# EasyEDA Pro project ProProject_【2023电赛】2023年电赛控制术_2023-08-01.epro, schematic v1
Create Date: 2023-07-21; Page Name: P1; Project Name: 【2023电赛】2023年电赛控制术; Schematic Name: v1; Update Date: 2023-07-31; Company: 桂林信息科技学院; Drawed: Jsir2022; Page Size: A4; Reviewed: QQ1171690935; Version: V1
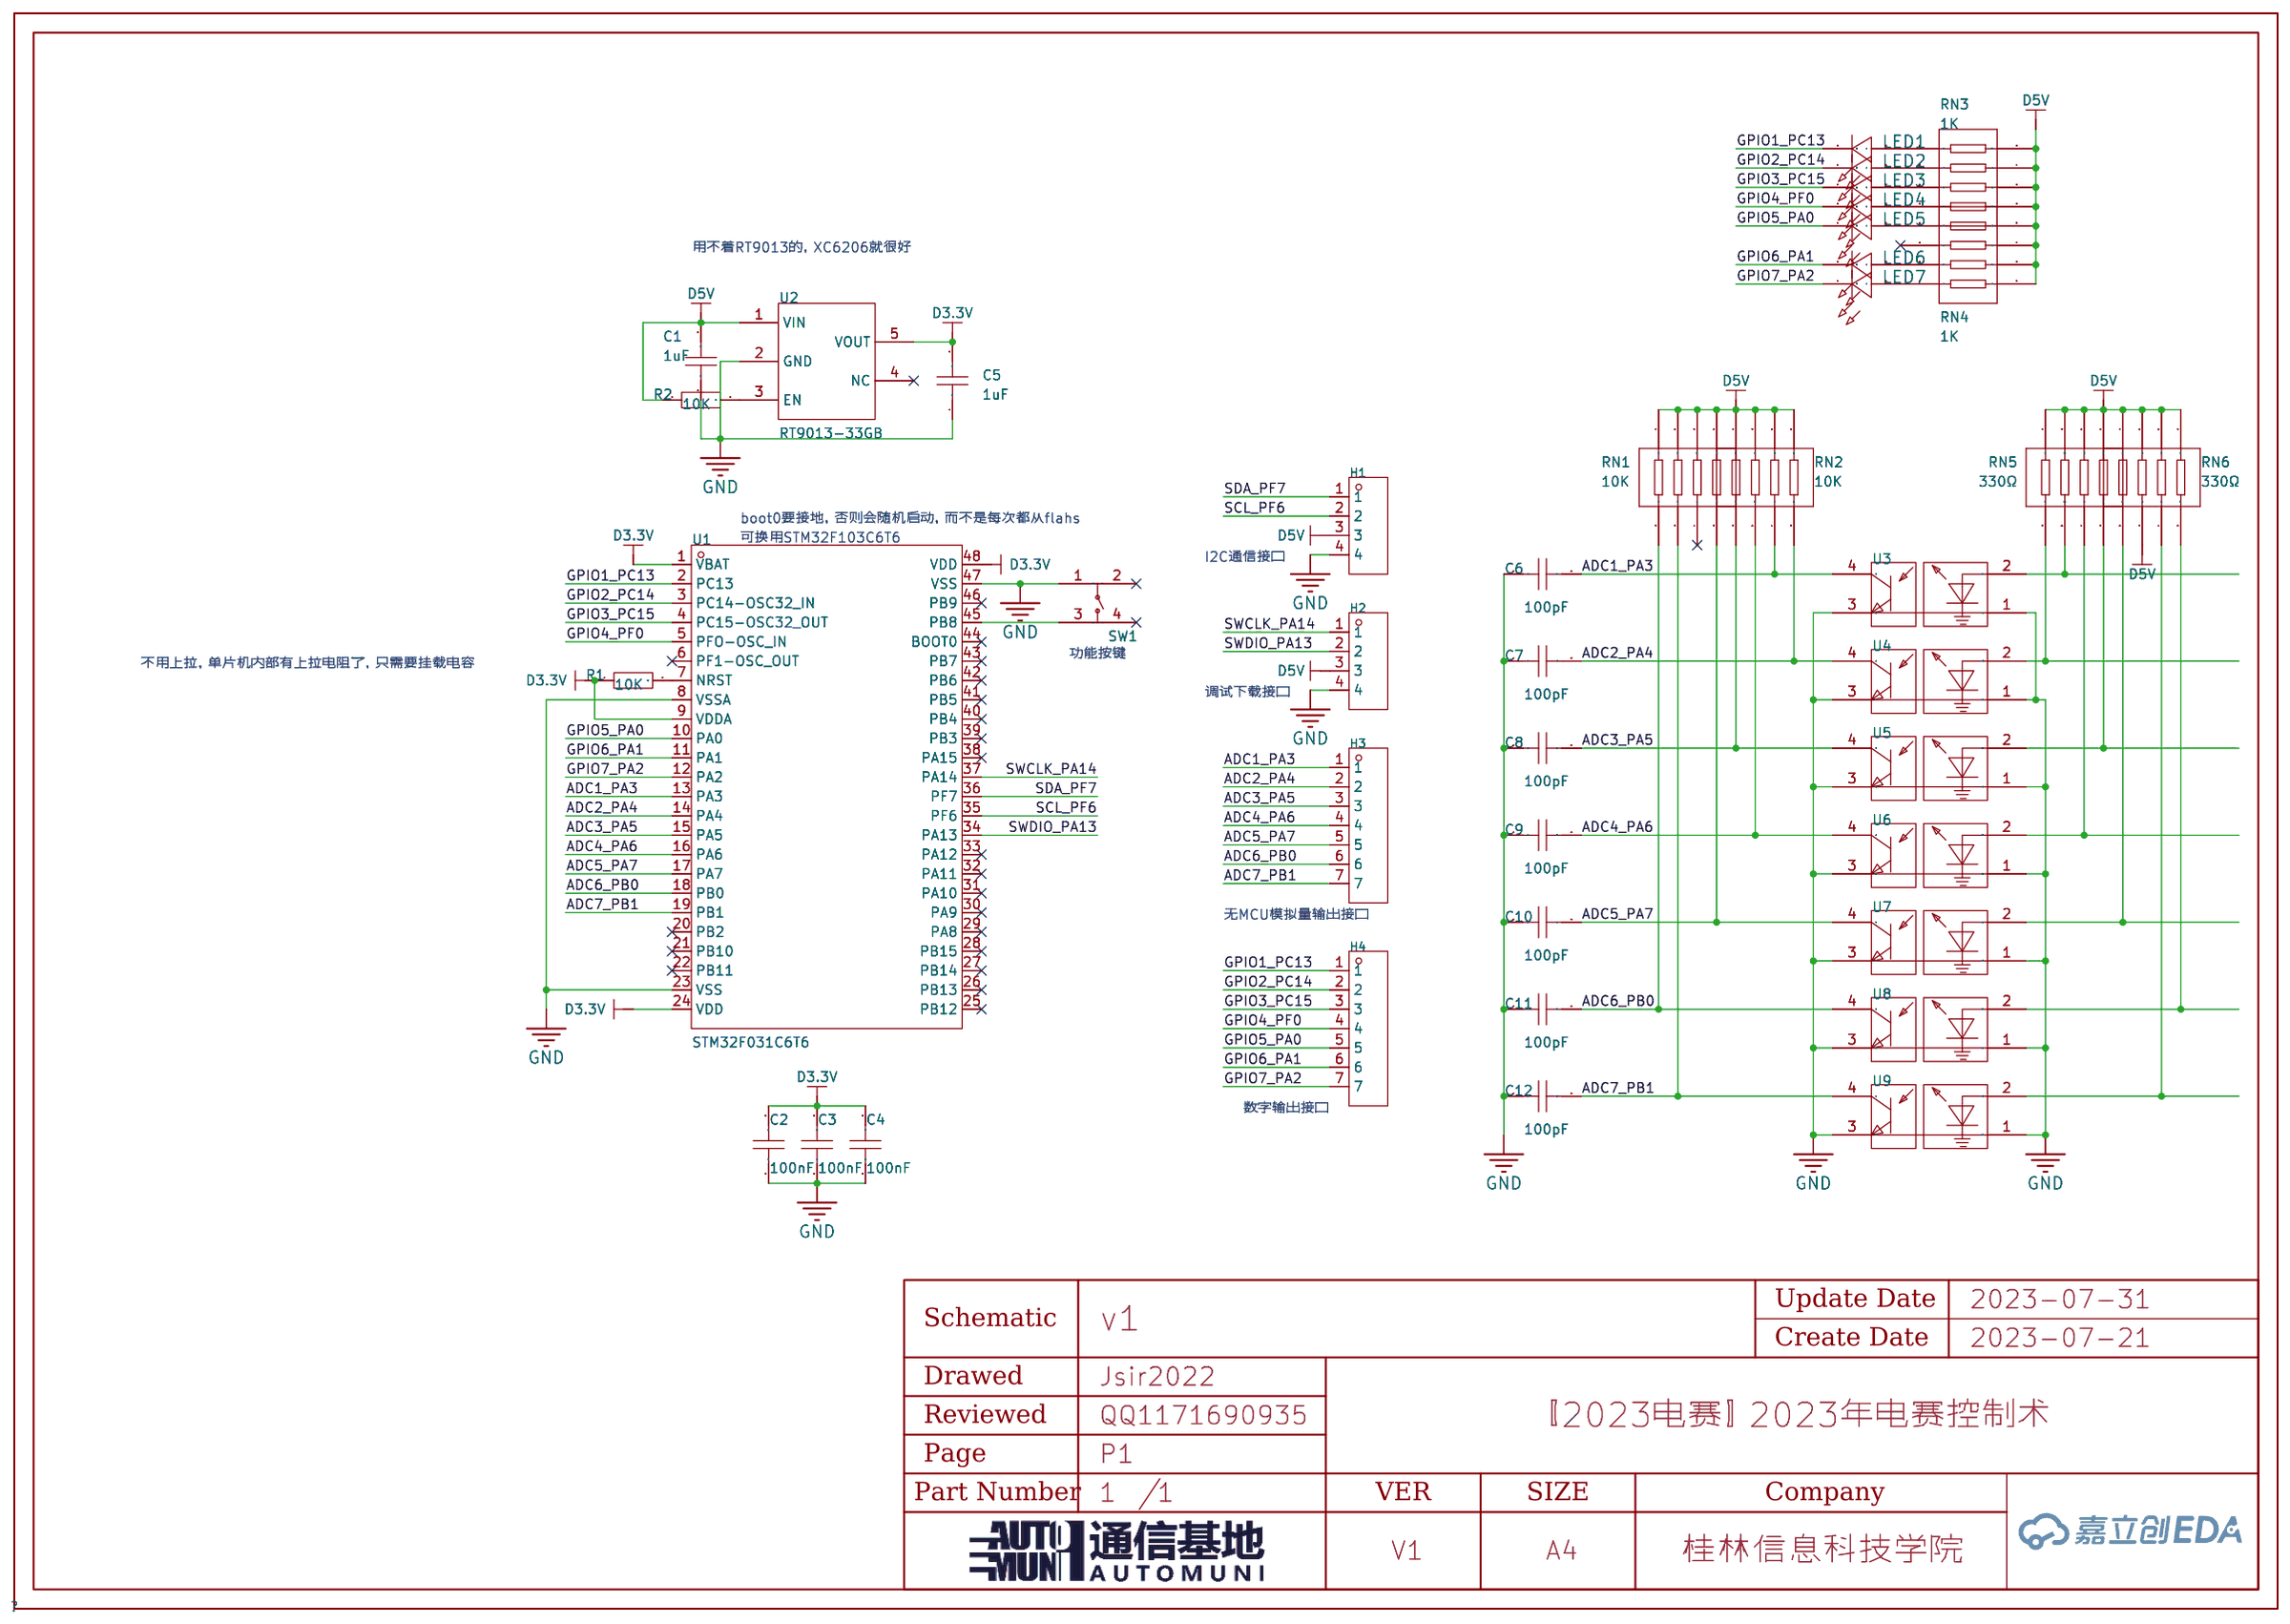
[diagram p0: schematic sheet]

## Parts
C1  1uF  [C0603]
C2  100nF  [C0603]
C3  100nF  [C0603]
C4  100nF  [C0603]
C5  1uF  [C0603]
C6  100pF  [C0603]
C7  100pF  [C0603]
C8  100pF  [C0603]
C9  100pF  [C0603]
C10  100pF  [C0603]
C11  100pF  [C0603]
C12  100pF  [C0603]
H1  -  [HDR-TH_4P-P2.54-V-M]
H2  -  [HDR-TH_4P-P2.54-V-M]
H3  -  [HDR-TH_7P-P2.54-V-M]
H4  -  [HDR-TH_7P-P2.54-V-M]
LED1  -  [LED_0603]
LED2  -  [LED_0603]
LED3  -  [LED_0603]
LED4  -  [LED_0603]
LED5  -  [LED_0603]
LED6  -  [LED_0603]
LED7  -  [LED_0603]
R1  10K  [R0603]
R2  10K  [R0603]
RN1  10K  [RES-ARRAY-SMD_0402-8P-L2.0-W1.0-BL]
RN2  10K  [RES-ARRAY-SMD_0402-8P-L2.0-W1.0-BL]
RN3  1K  [RES-ARRAY-SMD_0402-8P-L2.0-W1.0-BL]
RN4  1K  [RES-ARRAY-SMD_0402-8P-L2.0-W1.0-BL]
RN5  330Ω  [RES-ARRAY-SMD_0402-8P-L2.0-W1.0-BL]
RN6  330Ω  [RES-ARRAY-SMD_0402-8P-L2.0-W1.0-BL]
SW1  TS-1089S-AR02516  [SW-SMD_4P-L4.2-W3.3-P2.15-LS5.1]
U1  STM32F031C6T6  [LQFP-48_L7.0-W7.0-P0.50-LS9.0-BL]
U2  RT9013-33GB  [SOT-23-5_L3.0-W1.7-P0.95-LS2.8-BL]
U3  ITR9909  [OPTO-TH_ITR9909]
U4  ITR9909  [OPTO-TH_ITR9909]
U5  ITR9909  [OPTO-TH_ITR9909]
U6  ITR9909  [OPTO-TH_ITR9909]
U7  ITR9909  [OPTO-TH_ITR9909]
U8  ITR9909  [OPTO-TH_ITR9909]
U9  ITR9909  [OPTO-TH_ITR9909]

## Library data of the parts
C1-C12 = CAP_0603: Supplier Footprint: 0603
H1 H2 = HDR-M_2.54_1x4P: Supplier Part: C492403; Supplier Footprint: 插件
H3 H4 = HDR-M_2.54_1x7P: Supplier Part: C492406; Supplier Footprint: 插件
LED1-LED7 = LED_0603-R: Supplier Footprint: 0603
R1 R2 = Res_0603: Supplier Footprint: 0603
RN1-RN6 = YC124-JR-07330RL: 阻值:330Ω;精度:±5%;单个元件功率:62.5mW;电阻器数:4;; LCSC Part Name: 330Ω ±5% 0402x4; Supplier Part: C136846; Manufacturer: YAGEO(国巨); Supplier Footprint: 0402x4; JLCPCB Part Class: Extended Part; Datasheet: https://atta.szlcsc.com/upload/public/pdf/source/20171106/C136846_15099533593141092631.pdf; Supplier: LCSC; Tolerance: ±5%; Power(Watts): 62.5mW; Number of Resistors: 4; Number of Pins: 8; Temperature Coefficient: ±200ppm/℃
SW1 = TS-1089S-AR02516: 触点电流:50mA;额定电压(DC):12V;绝缘电阻:100MΩ;电路结构:单刀单掷;安装方式:立贴;按钮形状:椭圆形按钮;按钮/盖帽颜色:白色;作用力:160gf@±50gf;机械寿命:100000;工作温度:-30~+80;引脚样式:SMD接片;开关长度:4.2mm;开关宽度:3.25mm;开关高度:2.5mm;带支架:否;; LCSC Part Name: 342.5 160gf 轻触开关; Supplier Part: C720479; Manufacturer: XUNPU(讯普); Supplier Footprint: SMD; JLCPCB Part Class: Extended Part; Datasheet: https://atta.szlcsc.com/upload/public/pdf/source/20200810/C720479_389650BB8B865DD3822BD59B78D6CF64.pdf; Supplier: LCSC; Contact Current: 50mA; Voltage Rating (DC): 12V; Insulation Resistance: 100MΩ; Circuit: 单刀单掷; Mounting Style: 立贴; Actuator Style: 椭圆形按钮; Actuator/Cap Color: 白色; Operating Force: 160gf@±50gf; Mechanical Life: 100000; Operating Temperature: -30~+80; Pin Style: SMD接片; Switch Length: 4.2mm; Switch Width: 3.25mm; Switch Height: 2.5mm; Strike Gundam: 否
U1 = STM32F031C6T6: CPU内核:ARM Cortex-M0;CPU最大主频:48MHz;工作电压范围:2V~3.6V;内部振荡器:有;程序 FLASH容量:32K@x8bit;RAM总容量:4KB;EEPROM/数据 FLASH容量:-;GPIO端口数量:39;ADC(单元数/通道数/位数):1@x13ch/12bit;外设/功能/协议栈:DMA；看门狗；POR；PWM;工作温度范围:-40℃~+85℃;; LCSC Part Name: ARM Cortex-M0 48MHz 闪存：32K@x8bit RAM：4KB; Supplier Part: C97413; Manufacturer: ST(意法半导体); Supplier Footprint: LQFP-48(7x7); JLCPCB Part Class: Extended Part; Datasheet: https://atta.szlcsc.com/upload/public/pdf/source/20170925/C97413_1506321779757990583.pdf; Supplier: LCSC; CPU Core: ARM Cortex-M0; Maximum Frequency: 48MHz; Supply Voltage Range: 2V~3.6V; Internal Oscillator: 有; Program FLASH Size: 32K@x8bit; RAM Size: 4KB; GPIO Ports Number: 39; ADC (Units/Channels/bits): 1@x13ch/12bit; Peripherals / Functions / Protocol Stacks: DMA；看门狗；POR；PWM; Operating Temperature Range: -40℃~+85℃
U2 = RT9013-33GB: 输出类型:固定;输出极性:正;最大输入电压:5.5V;输出电压:3.3V;输出电流:500mA;电源纹波抑制比(PSRR):50dB@(10kHz);; Supplier Part: C47773; Manufacturer: RICHTEK(立锜); Supplier Footprint: SOT-23-5; JLCPCB Part Class: 扩展库; Datasheet: https://atta.szlcsc.com/upload/public/pdf/source/20150504/1457707282459.pdf; Supplier: LCSC; Output Type: 固定; Output Polarity: 正; Number of Outputs: 1; Maximum Input Voltage: 5.5V; Output Voltage: 3.3V; Dropout Voltage: 400mV@(500mA); Output Current: 500mA; Power Supply Rejection Ratio (PSRR): 50dB@(10kHz)
U3-U9 = ITR9909: Supplier Part: C53399; Manufacturer: EVERLIGHT(台湾亿光); Supplier Footprint: DIP-4; JLCPCB Part Class: Extended Part; Datasheet: https://atta.szlcsc.com/upload/public/pdf/source/20201022/C53399_E5C79523D84B21DC4419F8E709CCCF2E.pdf; Supplier: LCSC

## Nets
D3.3V: C2.2 C3.2 C4.2 C5.2 R1.1 U1.1(VBAT) U1.9(VDDA) U1.24(VDD) U1.48(VDD) U2.5(VOUT)
D5V: C1.2 H1.3 H2.3 R2.1 RN1.1 RN1.2 RN1.3 RN1.4 RN2.1 RN2.2 RN2.3 RN2.4 RN3.5 RN3.6 RN3.7 RN3.8 RN4.5 RN4.6 RN4.7 RN4.8 RN5.1 RN5.2 RN5.3 RN5.4 RN6.1 RN6.2 RN6.3 RN6.4 RN6.6 U2.1(VIN)
GND: C1.1 C2.1 C3.1 C4.1 C5.1 C6.1 C7.1 C8.1 C9.1 C10.1 C11.1 C12.1 H1.4 H2.4 SW1.1 U1.8(VSSA) U1.23(VSS) U1.47(VSS) U2.2(GND) U3.1 U3.3 U4.1 U4.3 U5.1 U5.3 U6.1 U6.3 U7.1 U7.3 U8.1 U8.3 U9.1 U9.3
ADC1_PA3: C6.2 H3.1 RN2.7 U1.13(PA3) U3.4
ADC2_PA4: C7.2 H3.2 RN2.8 U1.14(PA4) U4.4
ADC3_PA5: C8.2 H3.3 RN2.5 U1.15(PA5) U5.4
ADC4_PA6: C9.2 H3.4 RN2.6 U1.16(PA6) U6.4
ADC5_PA7: C10.2 H3.5 RN1.8 U1.17(PA7) U7.4
ADC6_PB0: C11.2 H3.6 RN1.5 U1.18(PB0) U8.4
ADC7_PB1: C12.2 H3.7 RN1.6 U1.19(PB1) U9.4
GPIO1_PC13: H4.1 LED1.1(C) U1.2(PC13)
GPIO2_PC14: H4.2 LED2.1(C) U1.3(PC14-OSC32_IN)
GPIO3_PC15: H4.3 LED3.1(C) U1.4(PC15-OSC32_OUT)
GPIO4_PF0: H4.4 LED4.1(C) U1.5(PFO-OSC_IN)
GPIO5_PA0: H4.5 LED5.1(C) U1.10(PA0)
GPIO6_PA1: H4.6 LED6.1(C) U1.11(PA1)
GPIO7_PA2: H4.7 LED7.1(C) U1.12(PA2)
SCL_PF6: H1.2 U1.35(PF6)
SDA_PF7: H1.1 U1.36(PF7)
SWCLK_PA14: H2.1 U1.37(PA14)
SWDIO_PA13: H2.2 U1.34(PA13)
$1N2447: R1.2 U1.7(NRST)
$1N4175: LED1.2(A) RN3.1
$1N4229: LED2.2(A) RN3.2
$1N4256: LED3.2(A) RN3.3
$1N4283: LED4.2(A) RN3.4
$1N4310: LED5.2(A) RN4.1
$1N5229: SW1.3 U1.45(PB8)
$1N5545: R2.2 U2.3(EN)
$1N6315: RN5.7 U6.2
$1N6322: RN5.8 U5.2
$1N6336: RN5.5 U4.2
$1N6418: RN5.6 U3.2
$1N6450: RN6.5 U7.2
$1N6471: RN6.8 U8.2
$1N6478: RN6.7 U9.2
$1N6514: LED7.2(A) RN4.4
$1N6542: LED6.2(A) RN4.3

Not connected (* = marked no-connect by the designer): RN1 7*; RN4 2*; SW1 2* 4*; U1 6(PF1-OSC_OUT)* 20(PB2)* 21(PB10)* 22(PB11)* 25(PB12)* 26(PB13)* 27(PB14)* 28(PB15)* 29(PA8)* 30(PA9)* 31(PA10)* 32(PA11)* 33(PA12)* 38(PA15)* 39(PB3)* 40(PB4)* 41(PB5)* 42(PB6)* 43(PB7)* 44(BOOT0)* 46(PB9)*; U2 4(NC)*

## Notes on the sheet
- 用不着RT9013的，XC6206就很好
- boot0要接地，否则会随机启动，而不是每次都从flahs
- 可换用STM32F103C6T6
- I2C通信接口
- 功能按键
- 不用上拉，单片机内部有上拉电阻了，只需要挂载电容
- 调试下载接口
- 无MCU模拟量输出接口
- 数字输出接口
